# Altium schematic sheet Main.SchDoc
size A4; SheetNumber: 1; SheetTotal: 1
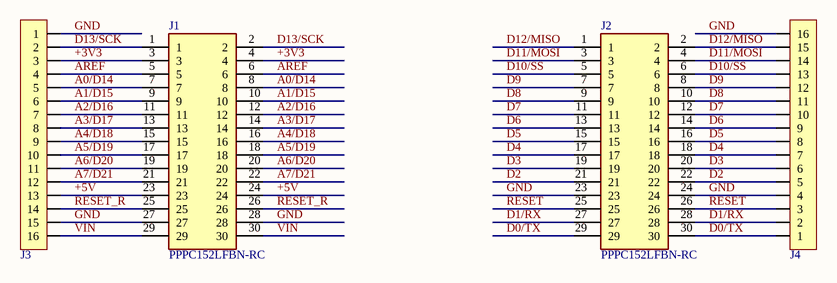
[diagram p0: Main.SchDoc]

## Parts
J1  PPPC152LFBN-RC  [RHDR30W80P254_2X15_3860X508X880P]
J2  PPPC152LFBN-RC  [RHDR30W80P254_2X15_3860X508X880P]
J3  22TW-277  [MK125002GO]  (value not drawn)
J4  22TW-277  [MK125002GO]  (value not drawn)

## Nets
+3V3: J1.3 J1.4 J3.3
+5V: J1.23 J1.24 J3.13
A0/D14: J1.7 J1.8 J3.5
A1/D15: J1.9 J1.10 J3.6
A2/D16: J1.11 J1.12 J3.7
A3/D17: J1.13 J1.14 J3.8
A4/D18: J1.15 J1.16 J3.9
A5/D19: J1.17 J1.18 J3.10
A6/D20: J1.19 J1.20 J3.11
A7/D21: J1.21 J1.22 J3.12
AREF: J1.5 J1.6 J3.4
D0/TX: J2.29 J2.30 J4.1
D1/RX: J2.27 J2.28 J4.2
D2: J2.21 J2.22 J4.5
D3: J2.19 J2.20 J4.6
D4: J2.17 J2.18 J4.7
D5: J2.15 J2.16 J4.8
D6: J2.13 J2.14 J4.9
D7: J2.11 J2.12 J4.10
D8: J2.9 J2.10 J4.11
D9: J2.7 J2.8 J4.12
D10/SS: J2.5 J2.6 J4.13
D11/MOSI: J2.3 J2.4 J4.14
D12/MISO: J2.1 J2.2 J4.15
D13/SCK: J1.1 J1.2 J3.2
GND: J1.27 J1.28 J2.23 J2.24 J3.1 J3.15 J4.4 J4.16
RESET: J2.25 J2.26 J4.3
RESET_R: J1.25 J1.26 J3.14
VIN: J1.29 J1.30 J3.16

## Notes on the sheet
- Project title:
- Variant:
- Rev:
- Page title:
- Date:
- Designed by:
- Sheet
- of

## Library data of the parts
J1 J2 = PPPC152LFBN-RC: CONN HDR 30POS 0.1 GOLD PCB; MF: Sullins; Geometry.Height: 8.8mm; MPN: PPPC152LFBN-RC; Datasheet Link: https://drawings-pdf.s3.amazonaws.com/10492.pdf; Supplier 1: Digikey; Supplier Part Number 1: S7118-ND
J3 J4 = J0275-A.6: CONN MORS.CS 16v p3,5 10A aLING.VER BLACK; Manufacturer: 4U CON; Code Arduino: J0275; Number of Contacts: 16; Pin Count: 16; Number of Conductors: 16; Max Current Rating: 10A; Part Number: 22TW-277